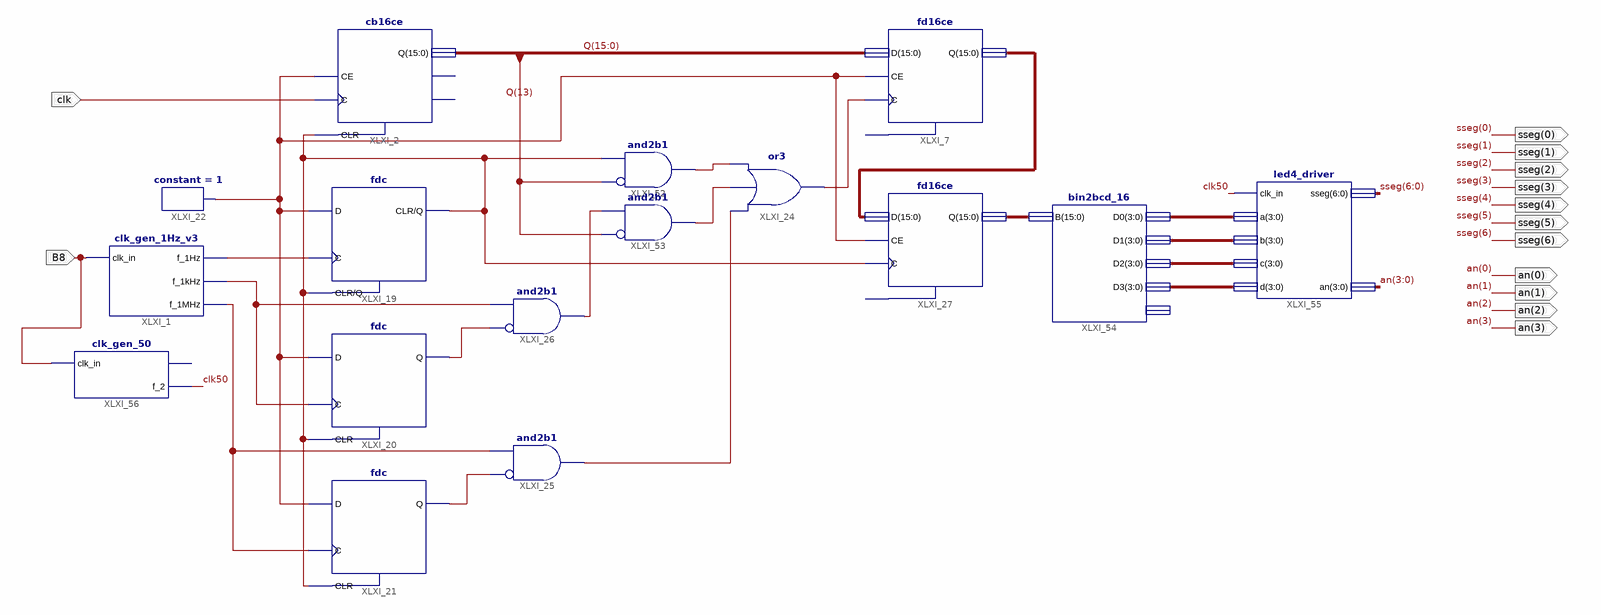
[diagram p0: schematic sheet 1]
// Xilinx ISE schematic czestotliwosci.sch (spartan3e) as structural Verilog: 16 symbols, 13 ports
module czestotliwosci (
  input  clk,
  input  B8,
  output [6:0] sseg,
  output [3:0] an
);

  wire clk50, XLXN_4, XLXN_5, XLXN_11, XLXN_12, XLXN_15, XLXN_32, XLXN_33, XLXN_37, XLXN_38, XLXN_92,
       XLXN_93, XLXN_95;
  wire [3:0] XLXN_97, XLXN_98, XLXN_99, XLXN_100;
  wire [15:0] Q, XLXN_85, XLXN_96;

  cb16ce XLXI_2 (.C(clk), .CE(XLXN_12), .CLR(XLXN_15), .Q(Q));  // open: CEO, TC
  fdc XLXI_19 (.C(XLXN_11), .CLR(XLXN_15), .D(XLXN_12), .Q(XLXN_15));
  fdc XLXI_20 (.C(XLXN_4), .CLR(XLXN_15), .D(XLXN_12), .Q(XLXN_38));
  fdc XLXI_21 (.C(XLXN_5), .CLR(XLXN_15), .D(XLXN_12), .Q(XLXN_37));
  clk_gen_1Hz_v3 XLXI_1 (.clk_in(B8), .f_1Hz(XLXN_11), .f_1kHz(XLXN_4), .f_1MHz(XLXN_5));
  constant #(.CValue("1")) XLXI_22 (.O(XLXN_12));
  and XLXI_25 (XLXN_33, ~XLXN_37, XLXN_5);  // and2b1
  and XLXI_26 (XLXN_95, ~XLXN_38, XLXN_4);  // and2b1
  or XLXI_24 (XLXN_32, XLXN_33, XLXN_92, XLXN_93);
  fd16ce XLXI_7 (.C(XLXN_32), .CE(XLXN_12), .D(Q), .Q(XLXN_85));  // open: CLR
  fd16ce XLXI_27 (.C(XLXN_15), .CE(XLXN_12), .D(XLXN_85), .Q(XLXN_96));  // open: CLR
  and XLXI_52 (XLXN_93, ~Q[13], XLXN_15);  // and2b1
  and XLXI_53 (XLXN_92, ~Q[13], XLXN_95);  // and2b1
  bin2bcd_16 XLXI_54 (.B(XLXN_96), .D2(XLXN_99), .D3(XLXN_100), .D1(XLXN_98), .D0(XLXN_97));  // open: D4
  led4_driver XLXI_55 (.clk_in(clk50), .a(XLXN_97), .b(XLXN_98), .c(XLXN_99), .d(XLXN_100), .sseg(sseg), .an(an));
  clk_gen_50 XLXI_56 (.clk_in(B8), .f_2(clk50));  // open: f_1
endmodule
